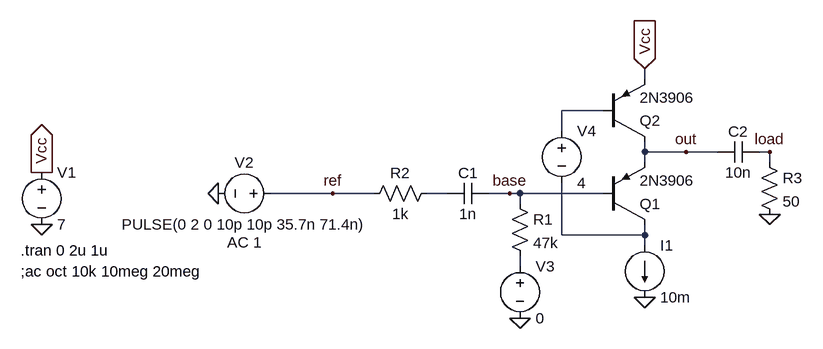
[diagram p0: schematic amplifier.asc]
amplifier.asc, the LTspice schematic file:
Version 4
SHEET 1 1448 680
WIRE 1152 -112 1152 -128
WIRE 1088 -64 1024 -64
WIRE 1024 -32 1024 -64
WIRE 1152 0 1152 -16
WIRE 1216 0 1152 0
WIRE 1264 0 1216 0
WIRE 1344 0 1328 0
WIRE 1152 16 1152 0
WIRE 1344 16 1344 0
WIRE 672 64 576 64
WIRE 736 64 672 64
WIRE 848 64 816 64
WIRE 944 64 912 64
WIRE 960 64 944 64
WIRE 1088 64 960 64
WIRE 960 80 960 64
WIRE 1024 128 1024 48
WIRE 1152 128 1152 112
WIRE 1152 128 1024 128
WIRE 1152 144 1152 128
WIRE 960 176 960 160
FLAG 496 64 0
FLAG 224 112 0
FLAG 224 32 Vcc
IOPIN 224 32 Out
FLAG 960 256 0
FLAG 1152 -128 Vcc
IOPIN 1152 -128 In
FLAG 1152 224 0
FLAG 1344 96 0
FLAG 944 64 base
FLAG 672 64 ref
FLAG 1216 0 out
FLAG 1344 0 load
SYMBOL res 832 48 R90
WINDOW 0 0 56 VBottom 2
WINDOW 3 32 56 VTop 2
SYMATTR InstName R2
SYMATTR Value 1k
SYMBOL cap 912 48 R90
WINDOW 0 0 32 VBottom 2
WINDOW 3 32 32 VTop 2
SYMATTR InstName C1
SYMATTR Value 1n
SYMBOL voltage 224 16 R0
WINDOW 123 0 0 Left 0
WINDOW 39 0 0 Left 0
SYMATTR InstName V1
SYMATTR Value 7
SYMBOL voltage 592 64 R90
WINDOW 0 -32 56 VBottom 2
WINDOW 3 32 56 VTop 2
WINDOW 123 60 56 VTop 2
WINDOW 39 0 0 Left 0
SYMATTR InstName V2
SYMATTR Value PULSE(0 2 0 10p 10p 35.7n 71.4n)
SYMATTR Value2 AC 1
SYMBOL res 944 64 R0
SYMATTR InstName R1
SYMATTR Value 47k
SYMBOL voltage 960 160 R0
WINDOW 123 0 0 Left 0
WINDOW 39 0 0 Left 0
SYMATTR InstName V3
SYMATTR Value 0
SYMBOL pnp 1088 112 M180
SYMATTR InstName Q1
SYMATTR Value 2N3906
SYMBOL pnp 1088 -16 M180
SYMATTR InstName Q2
SYMATTR Value 2N3906
SYMBOL current 1152 144 R0
WINDOW 123 0 0 Left 0
WINDOW 39 0 0 Left 0
SYMATTR InstName I1
SYMATTR Value 10m
SYMBOL voltage 1024 -48 R0
WINDOW 123 0 0 Left 0
WINDOW 39 0 0 Left 0
SYMATTR InstName V4
SYMATTR Value 4
SYMBOL res 1328 0 R0
SYMATTR InstName R3
SYMATTR Value 50
SYMBOL cap 1328 -16 R90
WINDOW 0 0 32 VBottom 2
WINDOW 3 32 32 VTop 2
SYMATTR InstName C2
SYMATTR Value 10n
TEXT 192 152 Left 2 !.tran 0 2u 1u
TEXT 192 184 Left 2 !;ac oct 10k 10meg 20meg

The netlist it stands for:
* amplifier.asc
R2 N002 ref 1k
C1 base N002 1n
V1 Vcc 0 7
V2 ref 0 PULSE(0 2 0 10p 10p 35.7n 71.4n) AC 1
R1 base N004 47k
V3 N004 0 0
Q1 N003 base out 0 2N3906
Q2 out N001 Vcc 0 2N3906
I1 N003 0 10m
V4 N001 N003 4
R3 load 0 50
C2 load out 10n
.model NPN NPN
.model PNP PNP
.lib standard.bjt
.tran 0 2u 1u
;ac oct 10k 10meg 20meg
.backanno
.end